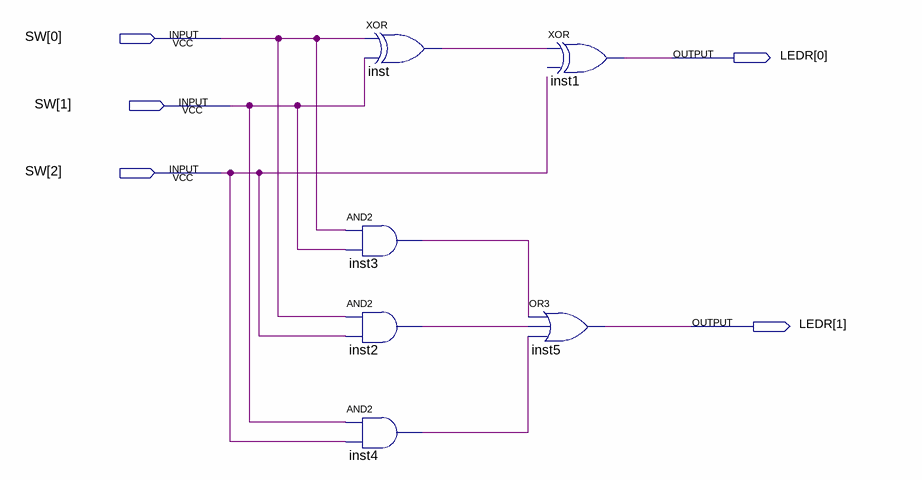
[diagram p0: schematic sheet]
// Quartus schematic lab1.bdf as structural Verilog: 6 symbols, 5 pins
module lab1 (
  input  [2:0] SW,
  output [1:0] LEDR
);

  wire inst2_out, inst3_out, inst4_out, inst_out;

  xor inst (inst_out, SW[0], SW[1]);
  and inst3 (inst3_out, SW[0], SW[1]);
  and inst2 (inst2_out, SW[0], SW[2]);
  and inst4 (inst4_out, SW[1], SW[2]);
  or inst5 (LEDR[1], inst3_out, inst2_out, inst4_out);
  buf inst1 (LEDR[0], inst_out);  // XOR open: IN2
endmodule
